# EAGLE design FM-Superregenerative-Receiver-1 (EAGLE 7.7.0)
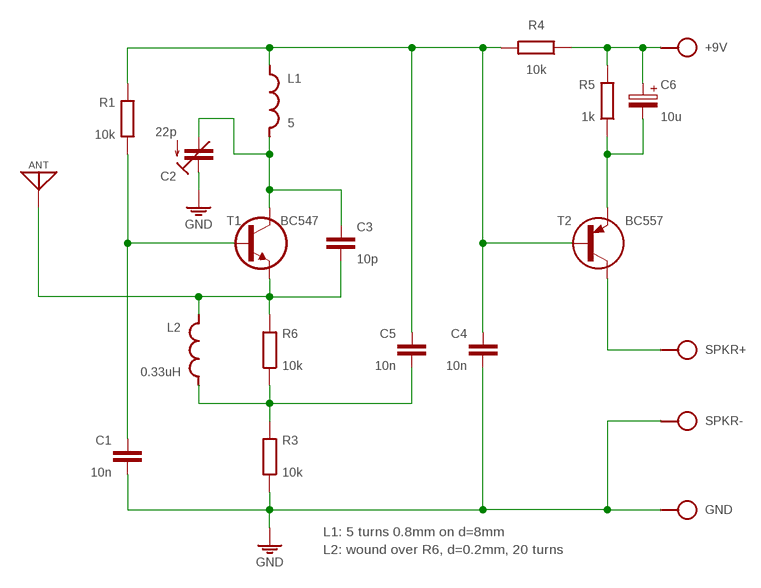
[diagram p0: schematic, sheet 1]

## Parts
+9V  SPAD  [SPAD]
ANT  ANT  [SPAD]
C1  10n  C050-025X075  [C050-025X075]
C2  22p  C-TR-PH201272222-808-2PIN  [TRIM-2222-808]
C3  10p  C050-020X036  [C050-020X036]
C4  10n  C050-025X075  [C050-025X075]
C5  10n  C050-025X075  [C050-025X075]
C6  10u  CPOLE2,5-3  [E2,5-3]
GND  SPAD  [SPAD]
L1  5  L-SHORT02/7V  [L-02/7V]
L2  0.33uH  L-SHORT02/7V  [L-02/7V]
R1  10k  R0202/7  [0202/7]
R3  10k  R0202/7-V  [0202/7-V]
R4  10k  R0202/7  [0202/7]
R5  1k  R0202/7-V  [0202/7-V]
R6  10k  R0202/7-V  [0202/7-V]
SPKR+  SPAD  [SPAD]
SPKR-  SPAD  [SPAD]
T1  BC547  BC547CBE  [TO92-CBE]
T2  BC557  BC557CBE  [TO92-CBE]

## Nets
GND: C1.2 C2.1(E) C4.2 GND.1 R3.1 SPKR-.1
N$1: C1.1 R1.1 T1.B
N$2: C6.- R5.1 T2.E
N$3: C5.2 L2.2 R3.2 R6.1
N$4: ANT.1 C3.2 L2.1 R6.2 T1.E
N$5: C4.1 C5.1 L1.1 R1.2 R4.2 T2.B
N$6: C2.2(A) C3.1 L1.2 T1.C
N$7: +9V.1 C6.+ R4.1 R5.2
N$8: SPKR+.1 T2.C

## Notes on the sheet
- L1: 5 turns 0.8mm on d=8mm
- L2: wound over R6, d=0.2mm, 20 turns

## Library data of the parts
+9V GND SPKR+ SPKR- = pad:SPAD
ANT = pad:ANT
C1 C3-C5 = c:C: CAPACITOR, European symbol
C2 = cap-trim:C-TR-PH20127
C6 = c:CPOL: POLARIZED CAPACITOR, European symbol
L1 L2 = r:L-SHORT
R1 R3-R6 = r:R: RESISTOR, European symbol
T1 = t:BC547
T2 = t:BC557

## Net classes
0 default: width 0.61 mm

## Board
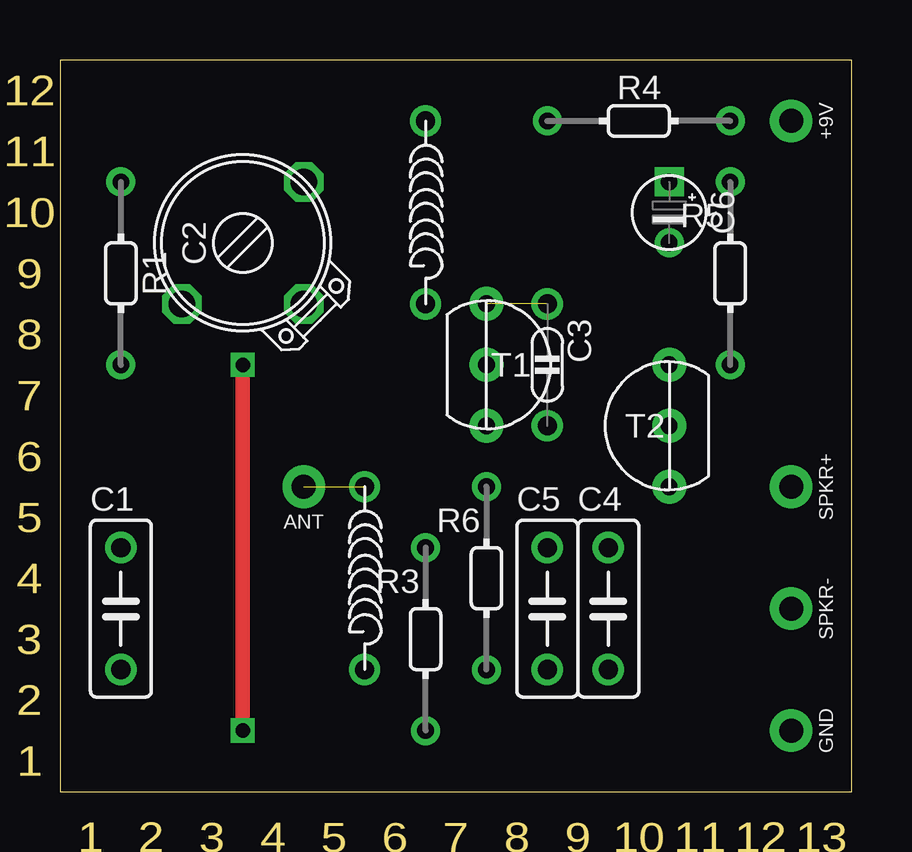
[diagram p1: board, top side]
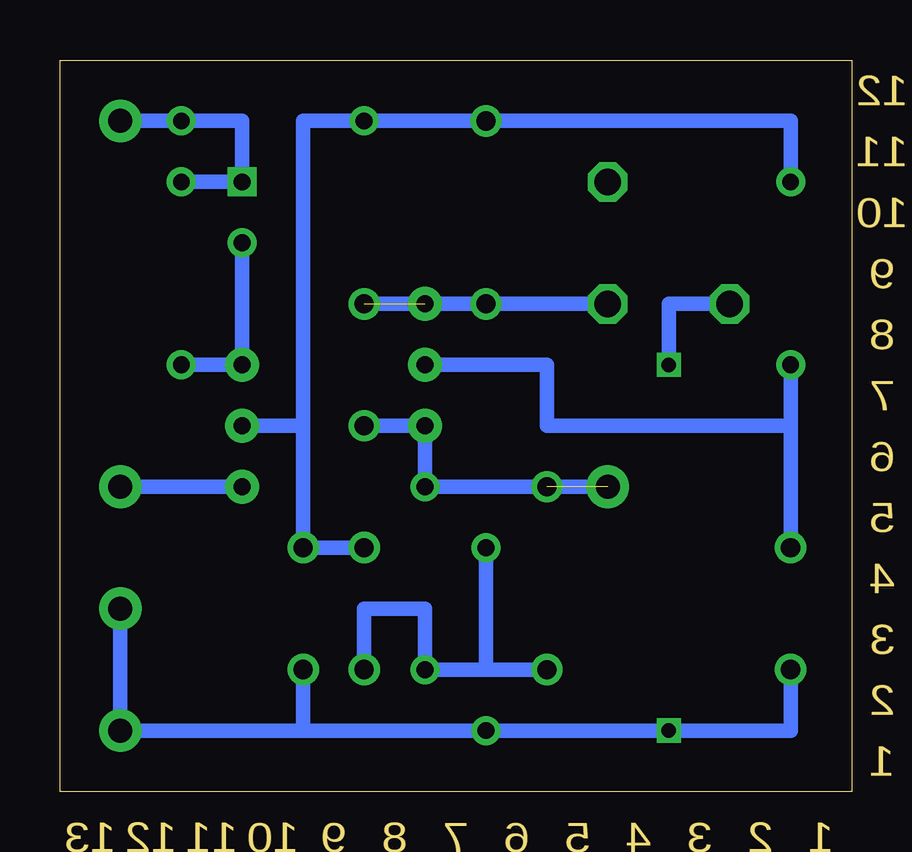
[diagram p2: board, bottom side, seen from below]

Size 33 x 30.48 mm. Coordinates in mm from the lower left corner, seen from the top.
Outline: 0,0 33,0 33,30.48 0,30.48 0,0
Copper layers (1*16): Top 0.035mm / dielectric 1.5mm / Bottom 0.035mm
Design rules "default": minimum track width 10mil, minimum drill 24mil, track to track 8mil, track to pad 8mil, pad to pad 8mil, via to via 8mil, smd to smd 8mil, copper to edge 40mil, drill to drill 8mil, minimum pad ring 10mil, minimum via ring 8mil, stop-mask expansion 4mil, vias tented up to drill 0mil, thermal gap 10mil

### Footprints (pad centres in the part's own frame; a part is rotated, then mirrored left to right if it is on the bottom)
SPAD = drill 1 pad 1.778: 1 0,0
C050-025X075 = drill 0.8: 1 2.54,0; 2 -2.54,0
TRIM-2222-808 = drill 1.1 octagon: 1 -2.54,2.54; 2 -2.54,-2.54; 3 2.54,-2.54
C050-020X036 = drill 0.8: 1 -2.54,0; 2 2.54,0
E2,5-3 = drill 0.7 square: + 0,1.27 | drill 0.7: - 0,-1.27
L-02/7V = drill 0.8: 1 0,3.81; 2 0,-3.81
0202/7 = drill 0.7: 1 0,3.81; 2 0,-3.81
0202/7-V = drill 0.7: 1 0,-3.81; 2 0,3.81
TO92-CBE = drill 0.7 pad 1.422: B 0,0; C 0,2.54; E 0,-2.54

### Placement (x,y rotation side)
+9V  30.48,27.94 180 top
ANT  10.16,12.7 90 top
C1  2.54,7.62 90 top
C2  7.62,22.86 90 top
C3  20.32,17.78 270 top
C4  22.86,7.62 90 top
C5  20.32,7.62 90 top
C6  25.4,24.13 0 top
GND  30.48,2.54 180 top
L1  15.24,24.13 0 top
L2  12.7,8.89 0 top
R1  2.54,21.59 180 top
R3  15.24,6.35 0 top
R4  24.13,27.94 270 top
R5  27.94,21.59 0 top
R6  17.78,8.89 0 top
SPKR+  30.48,12.7 180 top
SPKR-  30.48,7.62 180 top
T1  17.78,17.78 0 top
T2  25.4,15.24 180 top

### Tracks (layer width: path | path; a pad name or v marks a point on that pad's centre or on a via)
GND  (via drill 0.6)
  Top 0.61: v7.62,17.78 v7.62,2.54
  Bottom 0.61: 22.86,2.54 R3.1 v7.62,2.54 2.54,2.54 C1.2 | 22.86,2.54 GND.1 SPKR-.1 | C4.2 22.86,2.54 | v7.62,17.78 7.62,20.32 C2.1
N$1
  Bottom 0.61: C1.1 R1.1 2.54,15.24 12.7,15.24 12.7,17.78 T1.B
N$2
  Bottom 0.61: C6.- T2.E R5.1
N$3
  Bottom 0.61: L2.2 15.24,5.08 | R3.2 15.24,5.08 | 15.24,5.08 R6.1 17.78,7.62 20.32,7.62 C5.2
N$4  (1 unrouted)
  Bottom 0.61: C3.2 T1.E R6.2 ANT.1
N$5
  Bottom 0.61: R1.2 2.54,27.94 L1.1 R4.2 22.86,27.94 22.86,15.24 | 22.86,15.24 C4.1 C5.1 | 22.86,15.24 T2.B
N$6  (1 unrouted)
  Bottom 0.61: C3.1 L1.2 C2.2
N$7
  Bottom 0.61: +9V.1 R4.1 25.4,27.94 C6.+ R5.2
N$8
  Bottom 0.61: SPKR+.1 T2.C

### Text on the board
Dimension: 12 | 11 | 10 | 9 | 8 | 7 | 6 | 5 | 4 | 3 | 2 | 1 | 1 | 2 | 3 | 4 | 5 | 6 | 7 | 8 | 9 | 10 | 11 | 12 | 13